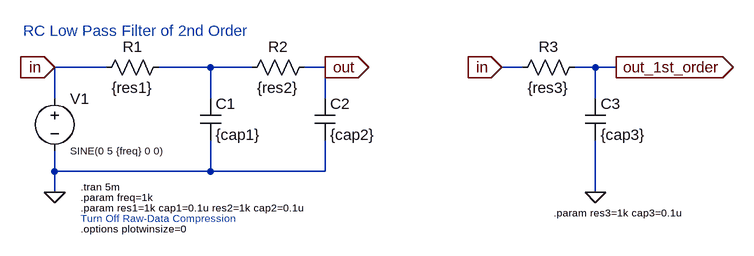
[diagram p0: schematic LowPassFilter_2ndOrder.asc]
LowPassFilter_2ndOrder.asc, the LTspice schematic file:
Version 4
SHEET 1 1136 680
WIRE 128 80 48 80
WIRE 288 80 208 80
WIRE 352 80 288 80
WIRE 464 80 432 80
WIRE 768 80 736 80
WIRE 880 80 848 80
WIRE 912 80 880 80
WIRE 48 128 48 80
WIRE 288 128 288 80
WIRE 464 128 464 80
WIRE 880 128 880 80
WIRE 48 240 48 208
WIRE 288 240 288 192
WIRE 288 240 48 240
WIRE 464 240 464 192
WIRE 464 240 288 240
WIRE 48 272 48 240
WIRE 880 272 880 192
FLAG 48 272 0
FLAG 48 80 in
IOPIN 48 80 In
FLAG 464 80 out
IOPIN 464 80 Out
FLAG 912 80 out_1st_order
IOPIN 912 80 Out
FLAG 736 80 in
IOPIN 736 80 In
FLAG 880 272 0
SYMBOL voltage 48 112 R0
WINDOW 3 24 96 Left 1
WINDOW 123 24 44 Left 2
WINDOW 39 0 0 Left 0
SYMATTR Value SINE(0 5 {freq} 0 0)
SYMATTR InstName V1
SYMBOL res 224 64 R90
WINDOW 0 0 56 VBottom 2
WINDOW 3 32 56 VTop 2
SYMATTR InstName R1
SYMATTR Value {res1}
SYMBOL cap 272 128 R0
SYMATTR InstName C1
SYMATTR Value {cap1}
SYMBOL res 448 64 R90
WINDOW 0 0 56 VBottom 2
WINDOW 3 32 56 VTop 2
SYMATTR InstName R2
SYMATTR Value {res2}
SYMBOL cap 448 128 R0
SYMATTR InstName C2
SYMATTR Value {cap2}
SYMBOL res 864 64 R90
WINDOW 0 0 56 VBottom 2
WINDOW 3 32 56 VTop 2
SYMATTR InstName R3
SYMATTR Value {res3}
SYMBOL cap 864 128 R0
SYMATTR InstName C3
SYMATTR Value {cap3}
TEXT 88 264 Left 1 !.tran 5m
TEXT 88 280 Left 1 !.param freq=1k
TEXT 88 296 Left 1 !.param res1=1k cap1=0.1u res2=1k cap2=0.1u
TEXT 88 328 Left 1 !.options plotwinsize=0
TEXT 88 312 Left 1 ;Turn Off Raw-Data Compression
TEXT 0 24 Left 2 ;RC Low Pass Filter of 2nd Order
TEXT 816 304 Left 1 !.param res3=1k cap3=0.1u

The netlist it stands for:
* LowPassFilter_2ndOrder.asc
V1 in 0 SINE(0 5 {freq} 0 0)
R1 N001 in {res1}
C1 N001 0 {cap1}
R2 out N001 {res2}
C2 out 0 {cap2}
R3 out_1st_order in {res3}
C3 out_1st_order 0 {cap3}
.tran 5m
.param freq=1k
.param res1=1k cap1=0.1u res2=1k cap2=0.1u
.options plotwinsize=0
* Turn Off Raw-Data Compression
* RC Low Pass Filter of 2nd Order
.param res3=1k cap3=0.1u
.backanno
.end